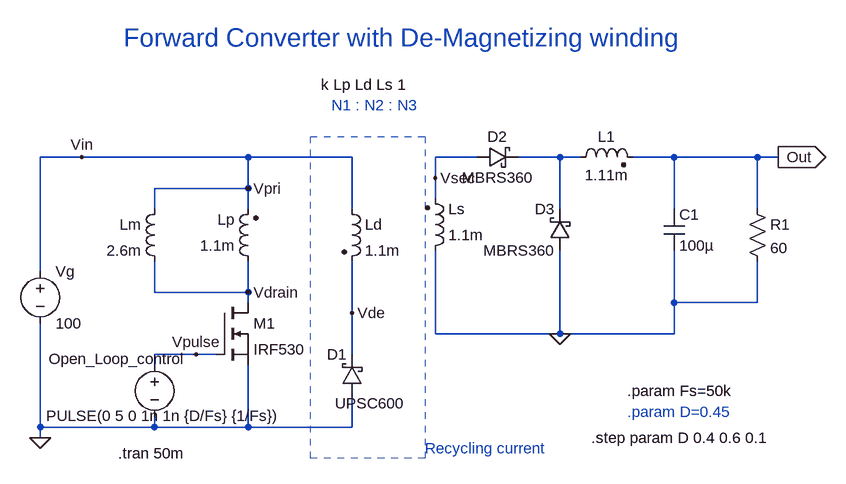
[diagram p0: schematic Forward_conv_Lossless Core Reset.asc]
Forward_conv_Lossless Core Reset.asc, the LTspice schematic file:
Version 4
SHEET 1 2432 792
WIRE -416 32 -480 32
WIRE -160 32 -416 32
WIRE 0 32 -160 32
WIRE 192 32 128 32
WIRE 320 32 256 32
WIRE 352 32 320 32
WIRE 496 32 432 32
WIRE 624 32 496 32
WIRE 656 32 624 32
WIRE 128 64 128 32
WIRE -160 80 -160 32
WIRE -160 80 -304 80
WIRE 128 96 128 64
WIRE -304 112 -304 80
WIRE -160 112 -160 80
WIRE 0 112 0 32
WIRE 320 112 320 32
WIRE 496 112 496 32
WIRE 624 112 624 32
WIRE -480 208 -480 32
WIRE -304 240 -304 192
WIRE -160 240 -160 192
WIRE -160 240 -304 240
WIRE -160 256 -160 240
WIRE 496 256 496 176
WIRE 624 256 624 192
WIRE 624 256 496 256
WIRE 0 272 0 192
WIRE 128 304 128 176
WIRE 320 304 320 176
WIRE 320 304 128 304
WIRE 496 304 496 256
WIRE 496 304 320 304
WIRE -240 336 -304 336
WIRE -208 336 -240 336
WIRE 0 336 0 272
WIRE -304 352 -304 336
WIRE -480 448 -480 288
WIRE -304 448 -304 432
WIRE -304 448 -480 448
WIRE -160 448 -160 352
WIRE -160 448 -304 448
WIRE 0 448 0 400
WIRE 0 448 -160 448
WIRE -480 464 -480 448
FLAG -480 464 0
FLAG 656 32 Out
IOPIN 656 32 Out
FLAG 320 304 0
FLAG -416 32 Vin
FLAG -240 336 Vpulse
FLAG -160 240 Vdrain
FLAG -160 80 Vpri
FLAG 0 272 Vde
FLAG 128 64 Vsec
SYMBOL schottky 192 48 R270
WINDOW 0 32 32 VTop 2
WINDOW 3 0 32 VBottom 2
SYMATTR InstName D2
SYMATTR Value MBRS360
SYMATTR Description Diode
SYMATTR Type diode
SYMBOL schottky 336 176 R180
WINDOW 0 24 64 Left 2
WINDOW 3 24 0 Left 2
SYMATTR InstName D3
SYMATTR Value MBRS360
SYMATTR Description Diode
SYMATTR Type diode
SYMBOL ind2 -144 208 R180
WINDOW 0 36 80 Left 2
WINDOW 3 36 40 Left 2
SYMATTR InstName Lp
SYMATTR Value 1.1m
SYMBOL ind2 112 192 M180
WINDOW 0 36 80 Left 2
WINDOW 3 36 40 Left 2
SYMATTR InstName Ls
SYMATTR Value 1.1m
SYMBOL cap 480 112 R0
SYMATTR InstName C1
SYMATTR Value 100µ
SYMBOL ind2 -16 96 R0
SYMATTR InstName Ld
SYMATTR Value 1.1m
SYMBOL schottky 16 400 R180
WINDOW 0 24 64 Left 2
WINDOW 3 -64 -11 Left 2
SYMATTR InstName D1
SYMATTR Value UPSC600
SYMATTR Description Diode
SYMATTR Type diode
SYMBOL voltage -480 192 R0
WINDOW 123 0 0 Left 0
WINDOW 39 0 0 Left 0
SYMATTR InstName Vg
SYMATTR Value 100
SYMBOL voltage -304 336 R0
WINDOW 123 0 0 Left 0
WINDOW 39 0 0 Left 0
WINDOW 0 -163 7 Left 2
WINDOW 3 -167 94 Left 2
SYMATTR InstName Open_Loop_control
SYMATTR Value PULSE(0 5 0 1n 1n {D/Fs} {1/Fs})
SYMBOL nmos -208 256 R0
SYMATTR InstName M1
SYMATTR Value IRF530
SYMBOL ind -288 96 M0
SYMATTR InstName Lm
SYMATTR Value 2.6m
SYMBOL res 608 96 R0
SYMATTR InstName R1
SYMATTR Value 60
SYMBOL ind2 336 48 R270
WINDOW 0 32 56 VTop 2
WINDOW 3 4 56 VBottom 2
SYMATTR InstName L1
SYMATTR Value 1.11m
TEXT -352 -152 Left 4 ;Forward Converter with De-Magnetizing winding
TEXT -48 -80 Left 2 !k Lp Ld Ls 1
TEXT 112 480 Left 2 ;Recycling current
TEXT 424 392 Left 2 !.param Fs=50k
TEXT -360 488 Left 2 !.tran 50m
TEXT -32 -48 Left 2 ;N1 : N2 : N3
TEXT 368 464 Left 2 !.step param D 0.4 0.6 0.1
TEXT 424 424 Left 2 ;.param D=0.45
RECTANGLE Normal 112 496 -64 0 2

The netlist it stands for:
* Forward_conv_Lossless Core Reset.asc
D2 Vsec N001 MBRS360
D3 0 N001 MBRS360
Lp Vdrain Vpri 1.1m
Ls 0 Vsec 1.1m
C1 Out 0 100µ
Ld Vpri Vde 1.1m
D1 0 Vde UPSC600
Vg Vpri 0 100
V§Open_Loop_control Vpulse 0 PULSE(0 5 0 1n 1n {D/Fs} {1/Fs})
M1 Vdrain Vpulse 0 0 IRF530
Lm Vpri Vdrain 2.6m
R1 Out 0 60
L1 N001 Out 1.11m
.model D D
.lib standard.dio
.model NMOS NMOS
.model PMOS PMOS
.lib standard.mos
* Forward Converter with De-Magnetizing winding
k Lp Ld Ls 1
* Recycling current
.param Fs=50k
.tran 50m
* N1 : N2 : N3
.step param D 0.4 0.6 0.1
* .param D=0.45
.backanno
.end